# Altium schematic sheet Sheet2.SchDoc
size A
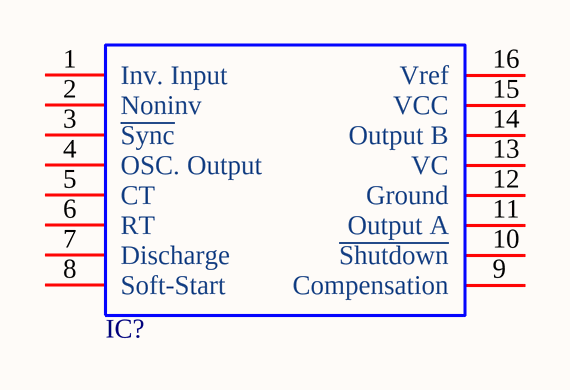
[diagram p0: Sheet2.SchDoc]

## Parts
IC?  Pulse width modulator control circuits  [SO16]  (value not drawn)

## Nets

Not connected (* = marked no-connect by the designer): IC? 1(Inv._Input) 2(Noninv) 3(~{Sync}) 4(OSC._Output) 5(CT) 6(RT) 7(Discharge) 8(Soft-Start) 9(Compensation) 10(~{Shutdown}) 11(Output_A) 12(Ground) 13(VC) 14(Output_B) 15(VCC) 16(Vref)

## Library data of the parts
IC? = SG3525AN